# EAGLE design PWR (EAGLE 8.7.1)
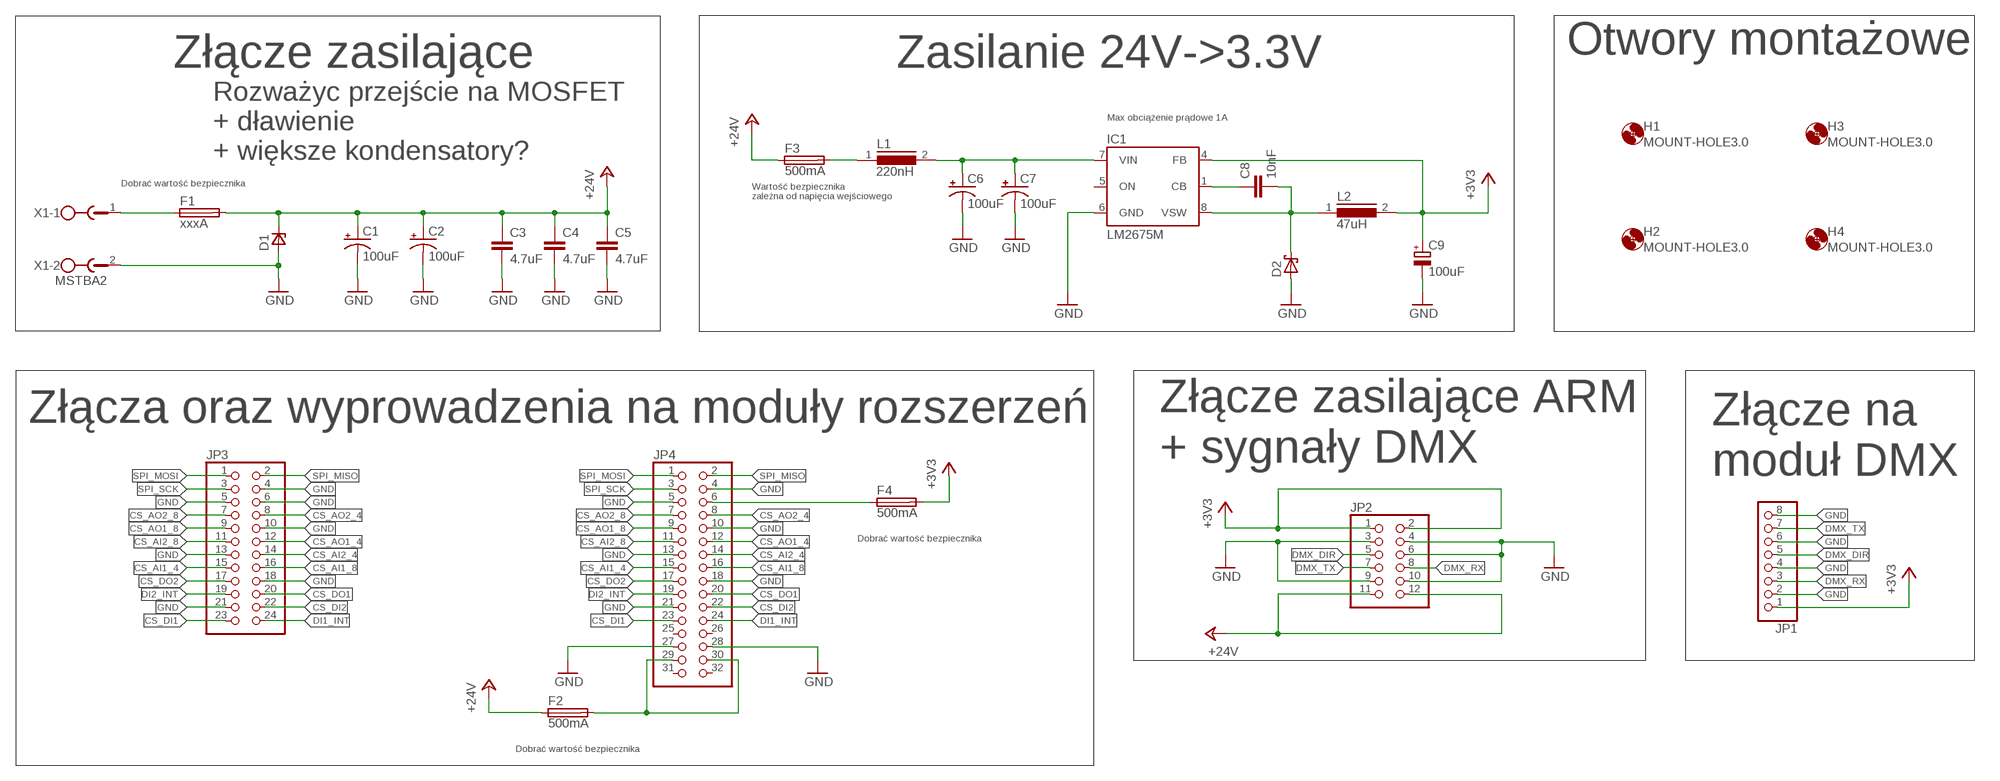
[diagram p0: schematic, sheet 1]

## Parts
C1  100uF  CPOL-USTT5D10  [TT5D10]
C2  100uF  CPOL-USTT5D10  [TT5D10]
C3  4.7uF  C-EUC0805  [C0805]
C4  4.7uF  C-EUC0805  [C0805]
C5  4.7uF  C-EUC0805  [C0805]
C6  100uF  CPOL-USTT5D10  [TT5D10]
C7  100uF  CPOL-USTT5D10  [TT5D10]
C8  10nF  C-EUC0603  [C0603]
C9  100uF  CPOL-EUSMCC  [SMC_C]
D1  P6SMB20A  [SMB_A]
D2  SCHOTTKY-DIODESMD  [SMB]
F1  xxxA  TR5  [TR5]
F2  500mA  TR5  [TR5]
F3  500mA  TR5  [TR5]
F4  500mA  TR5  [TR5]
H1  MOUNT-HOLE3.0  [3,0]
H2  MOUNT-HOLE3.0  [3,0]
H3  MOUNT-HOLE3.0  [3,0]
H4  MOUNT-HOLE3.0  [3,0]
IC1  LM2675M  [SO08]
JP1  PINHD-1X8/90  [1X08/90]
JP2  PINHD-2X6  [2X06]
JP3  PINHD-2X12  [2X12]
JP4  PINHD-2X16/90  [2X16/90]
L1  220nH  SRP7028A-R33M  [7.3X6.3]
L2  47uH  SRR1280-101M  [12.5X12.5]
X1  MSTBA2  [MSTBA2]

## Nets
+3V3: C9.+ F4.2 IC1.4(FB) JP1.1 JP2.1 JP2.2 L2.2
+24V: C1.+ C2.+ C3.1 C4.1 C5.1 D1.C F1.2 F2.1 F3.1 JP2.11 JP2.12
CS_AI1_4: JP3.15 JP4.15
CS_AI1_8: JP3.16 JP4.16
CS_AI2_4: JP3.14 JP4.14
CS_AI2_8: JP3.11 JP4.11
CS_AO1_4: JP3.12 JP4.12
CS_AO1_8: JP3.9 JP4.9
CS_AO2_4: JP3.8 JP4.8
CS_AO2_8: JP3.7 JP4.7
CS_DI1: JP3.23 JP4.23
CS_DI2: JP3.22 JP4.22
CS_DO1: JP3.20 JP4.20
CS_DO2: JP3.17 JP4.17
DI1_INT: JP3.24 JP4.24
DI2_INT: JP3.19 JP4.19
DMX_DIR: JP1.5 JP2.5
DMX_RX: JP1.3 JP2.8
DMX_TX: JP1.7 JP2.7
GND: C1.- C2.- C3.2 C4.2 C5.2 C6.- C7.- C9.- D1.A D2.A IC1.6(GND) JP1.2 JP1.4 JP1.6 JP1.8 JP2.3 JP2.4 JP2.6 JP2.9 JP2.10 JP3.4 JP3.5 JP3.6 JP3.10 JP3.13 JP3.18 JP3.21 JP4.4 JP4.5 JP4.10 JP4.13 JP4.18 JP4.21 JP4.27 JP4.28 X1.2
N$1: F1.1 X1.1
N$2: F4.1 JP4.6
N$3: F2.2 JP4.29 JP4.30
N$10: F3.2 L1.1
N$16: C8.1 IC1.1(CB)
SPI_MISO: JP3.2 JP4.2
SPI_MOSI: JP3.1 JP4.1
SPI_SCK: JP3.3 JP4.3
VIN: C6.+ C7.+ IC1.7(VIN) L1.2
VSW: C8.2 D2.C IC1.8(VSW) L2.1
Unconnected: IC1.5(ON) JP4.25 JP4.26 JP4.31 JP4.32

## Notes on the sheet
- Złącze zasilające | Zasilanie 24V->3.3V | Otwory montażowe
- Max obciążenie prądowe 1A
- Rozważyc przejście na MOSFET
  + dławienie
  + większe kondensatory?
- Dobrać wartość bezpiecznika
- Wartość bezpiecznika 
  zależna od napięcia wejściowego
- Złącza oraz wyprowadzenia na moduły rozszerzeń
- Złącze zasilające ARM
  + sygnały DMX
- Złącze na
  moduł DMX
- Dobrać wartość bezpiecznika
- Dobrać wartość bezpiecznika

## Library data of the parts
C1 C2 C6 C7 = rcl:CPOL-US: POLARIZED CAPACITOR, American symbol; MF: Nichicon; MPN: UPJ1H101MPD6; SPICEPREFIX: C
C3-C5 = rcl:C-EU: CAPACITOR, European symbol; MF: Murata Electronics; MPN: GRM21BR61H475ME51L; SPICEPREFIX: C
C8 = rcl:C-EU: CAPACITOR, European symbol; MF: AVX; MPN: 06035C103KAT2A; SPICEPREFIX: C
C9 = rcl:CPOL-EU: POLARIZED CAPACITOR, European symbol; MF: AVX; MPN: TAJC107K010TNJ; SPICEPREFIX: C
D1 = suppressor_SMAJ_SM6T_P6SMB:P6SMB*A: P6SMBxxA Series of unidirectional Transient Voltage Suppressor Diodes xx = Stand-off Voltage VR in Volts; PPmax = 600 W Case: SMB = DO 214 AA Note: Footprint acc. to ST specs; source: www.st.com Author: Dipl.-Ing. FH Rainer Bayer, www.ing-rb.de/hhn Feedback: rainer.bayer@hs-heilbronn.de; MF: Littelfuse; MPN: TPSMB24A-VR
D2 = diode:SCHOTTKY-DIODE: Schottky Diode; MF: ON Semiconductor; MPN: SS26T3G
F1-F4 = fuse:TR5: FUSE Wickmann; MF: Littelfuse; MPN: 56000001009; OC_FARNELL: unknown; OC_NEWARK: unknown
H1-H4 = holes:MOUNT-HOLE: MOUNTING HOLE with drill center marker
IC1 = v-reg-3:LM2675: National Semiconductor <http://www.national.com> 1.0A "Simple Switcher"(c) 260kHz, Vout 1.2-37V, Vin 40V, 250mOhm DMOS switch, 50µA standby current; MF: Texas Instruments; MPN: LM2675MX-3.3/NOPB
JP1 = pinhead:PINHD-1X8: PIN HEADER; MF: CONNFLY; MPN: DS1024-1*8R0
JP2 = pinhead:PINHD-2X6: PIN HEADER; MF: CONNFLY; MPN: DS1023-2*6S21
JP3 = pinhead:PINHD-2X12: PIN HEADER; MF: CONNFLY; MPN: DS1023-2*12S21
JP4 = pinhead:PINHD-2X16: PIN HEADER; MF: CONNFLY; MPN: DS1024-2*16R0
L1 = wlasne:SRP7028A-R33M: SRP7028A-R33M Manufacturer: Bourns Product Category: Fixed Inductors RoHS: Details Series: SRP7028A Inductance: 330 nH Tolerance: 20 % Maximum DC Current: 32 A Maximum DC Resistance: 3.9 mOhms Minimum Operating Temperature: - 40 C Maximum Operating Temperature: + 150 C Q Minimum: 10 Test Frequency: 100 kHz Product: Power Inductors Shielding: Shielded Termination Style: SMD/SMT Termination: - Mounting Style: SMD/SMT Length: 7.3 mm Width: 6.6 mm Height: 2.8 mm Qualification: AEC-Q200 Packaging: Cut Tape Packaging: MouseReel Packaging: Reel Type: AEC-Q200 Shielded Power Inductor Core Material: Carbonyl Iron Powder Self Resonant Frequency: 140 MHz Brand: Bourns Factory Pack Quantity: 1000 Unit Weight: 1 g; MF: Bourns; MPN: SRP7028A-R22Y
L2 = wlasne:SRR1280-101M: SRR1280-101M Manufacturer: Bourns Product Category: Fixed Inductors RoHS: Details Series: SRR1280 Inductance: 100 uH Tolerance: 20 % Maximum DC Current: 2.1 A Maximum DC Resistance: 150 mOhms Minimum Operating Temperature: - 40 C Maximum Operating Temperature: + 125 C Q Minimum: 18 Product: Power Inductors Shielding: Shielded Termination Style: SMD/SMT Termination: - Mounting Style: SMD/SMT Package/Case: 5050 Length: 12.5 mm Width: 12.5 mm Height: 7.5 mm Packaging: Cut Tape Packaging: MouseReel Packaging: Reel Type: Shielded Power Inductor Self Resonant Frequency: 4.5 MHz Brand: Bourns Factory Pack Quantity: 400 Unit Weight: 4,200 g; MF: Bourns; MPN: SRR1280-470M
X1 = con-phoenix-508:MSTBA2: PHOENIX; MF: DEGSON ELECTRONICS; MPN: 2EDGRC-5.08-02P-14-00A(H); OC_FARNELL: 3705171; OC_NEWARK: 71C4161

## Board
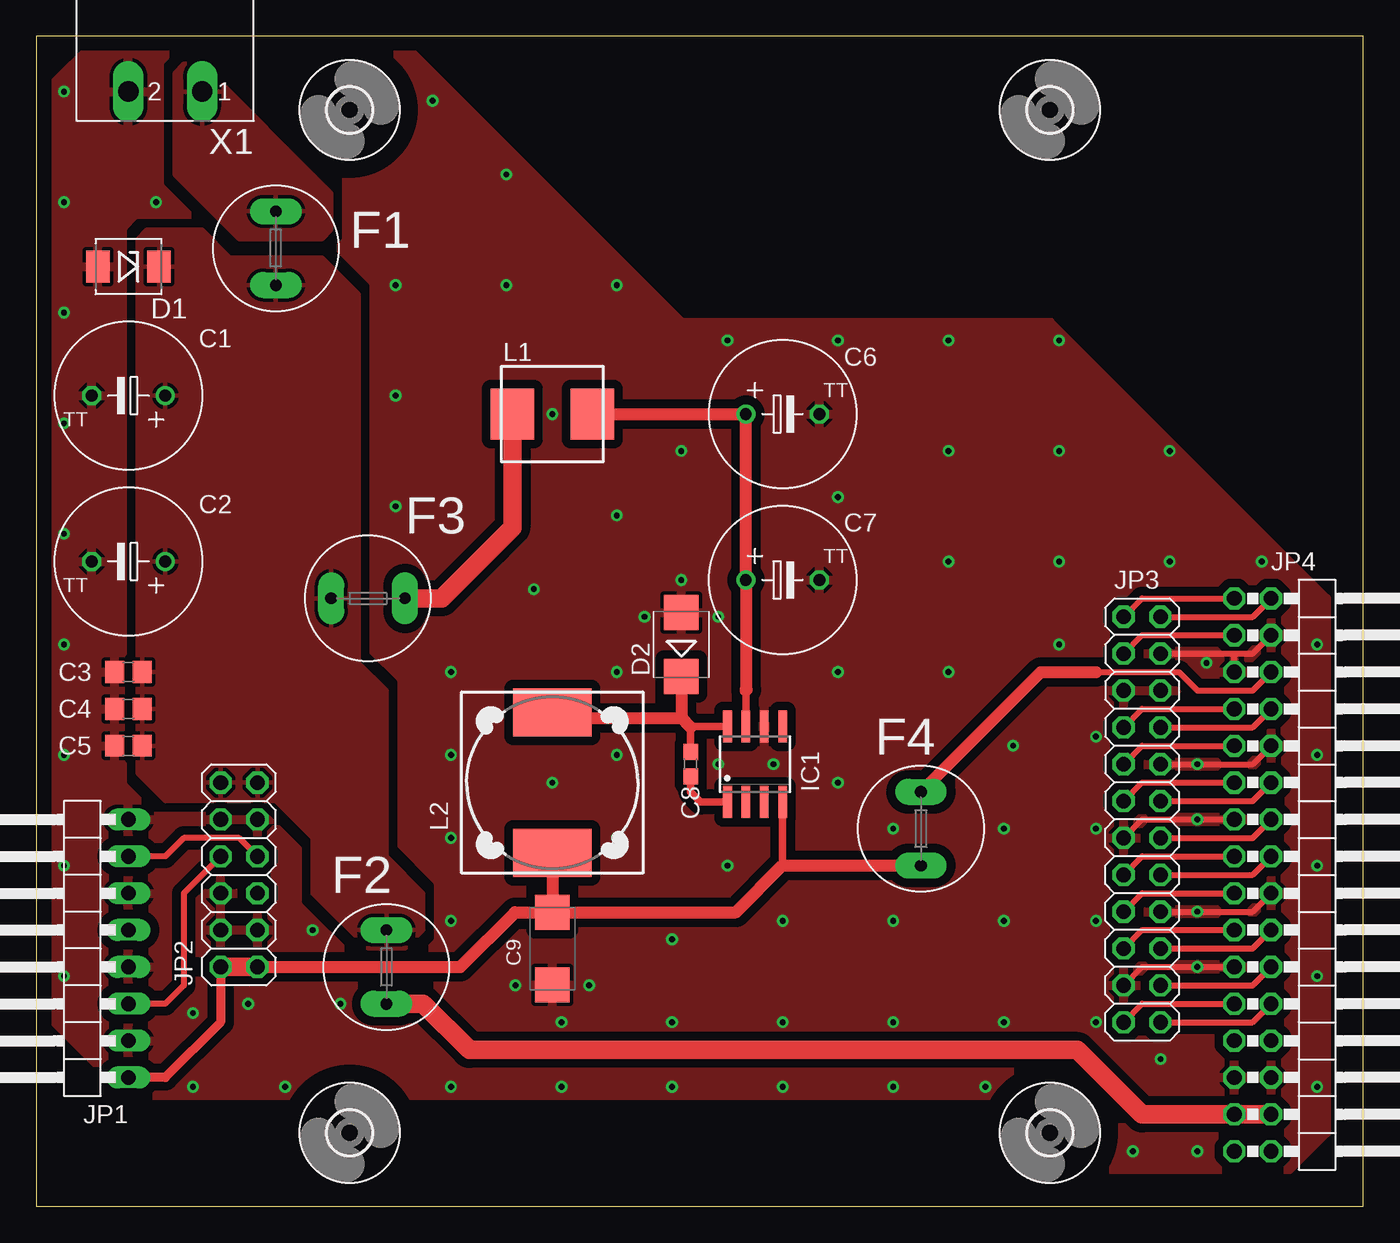
[diagram p1: board, top side]
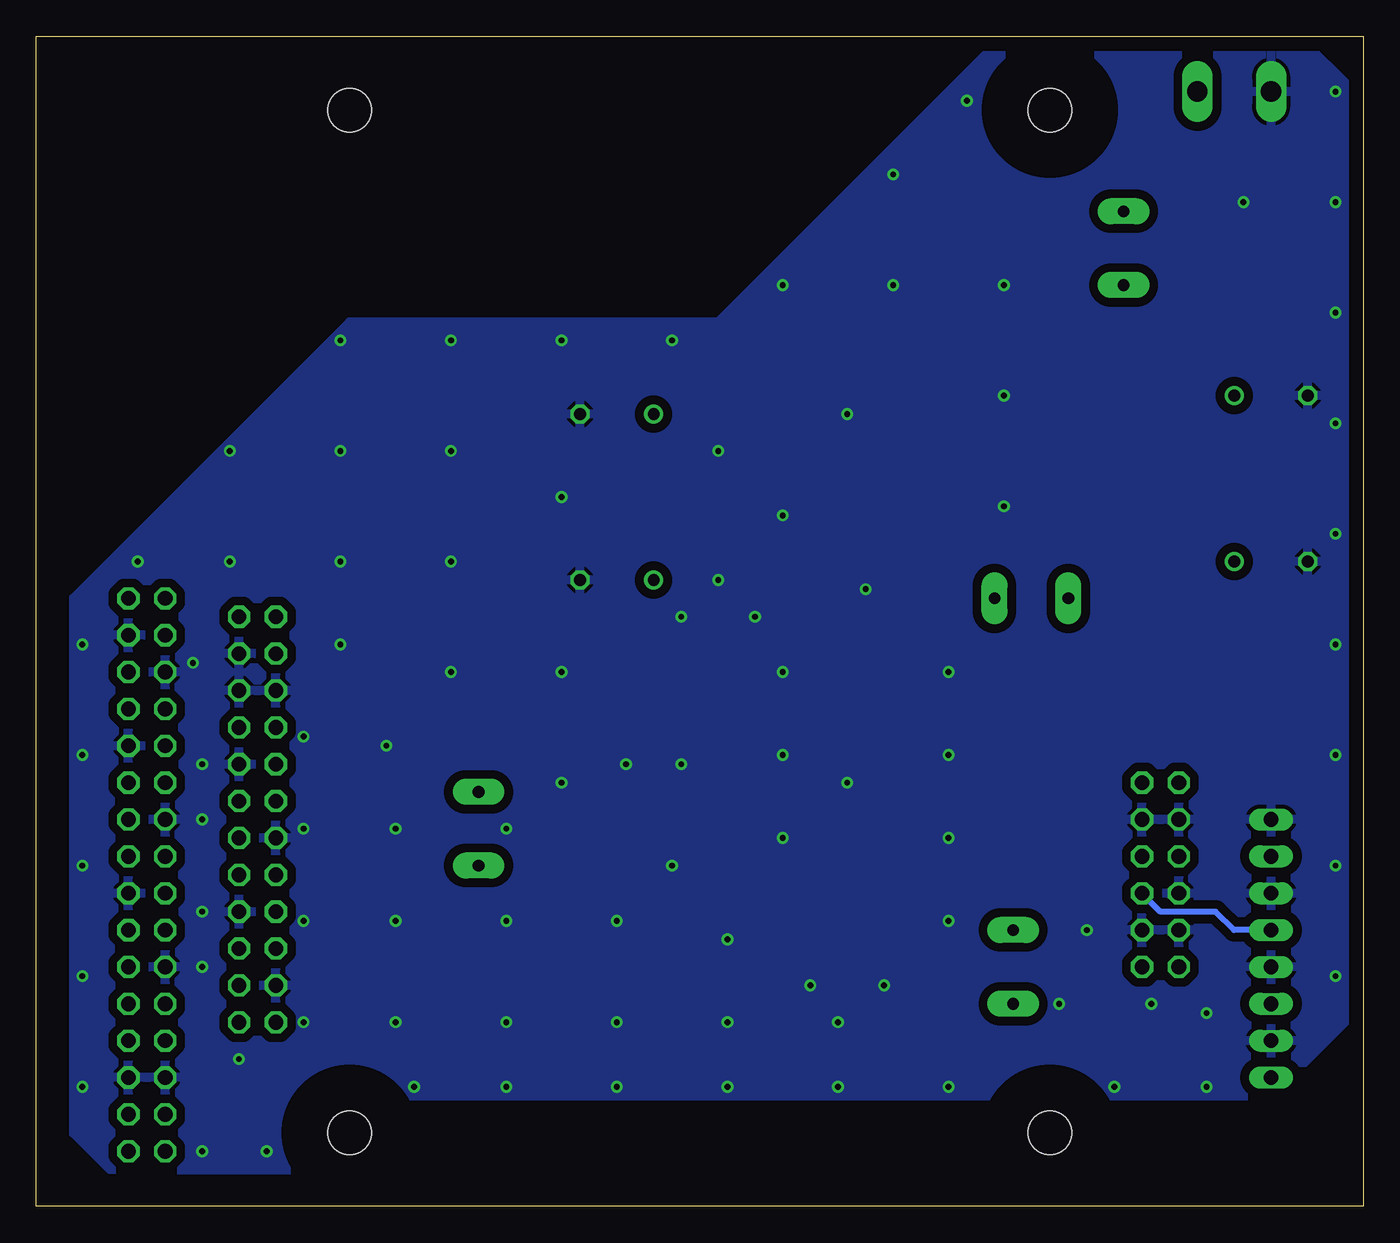
[diagram p2: board, bottom side, seen from below]

Size 91.44 x 80.64 mm. Coordinates in mm from the lower left corner, seen from the top.
Outline: 0,0 91.44,0 91.44,80.64 0,80.64 0,0
Copper layers (1*16): Top 0.035mm / dielectric 1.5mm / Bottom 0.035mm
Design rules "default *": minimum track width 6mil, minimum drill 0.4mm, track to track 10mil, track to pad 10mil, pad to pad 10mil, via to via 12mil, smd to smd 6mil, copper to edge 1mm, drill to drill 6mil, minimum pad ring 10mil, minimum via ring 8mil, stop-mask expansion 4mil, vias tented up to drill 0mil, thermal gap 10mil

### Footprints (pad centres in the part's own frame; a part is rotated, then mirrored left to right if it is on the bottom)
TT5D10 = drill 0.813: + -2.54,0 | drill 0.813 octagon: - 2.54,0
C0805 = smd 1.3 x 1.5: 1 -0.95,0; 2 0.95,0
C0603 = smd 1.1 x 1: 1 -0.85,0; 2 0.85,0
SMC_C = smd 2.4 x 2.4: + -2.5,0; - 2.5,0
SMB_A = smd 1.62 x 2.18: A 2.11,0; C -2.11,0
SMB = smd 2.4 x 2.4: A 2.2,0; C -2.2,0
TR5 = drill 0.813 pad 1.778 long: 1 -2.54,0; 2 2.54,0
3,0 = hole 3: 0,0
SO08 = smd 0.6 x 2.2: 1 -1.905,-2.6; 2 -0.635,-2.6; 3 0.635,-2.6; 4 1.905,-2.6; 5 1.905,2.6; 6 0.635,2.6; 7 -0.635,2.6; 8 -1.905,2.6
1X08/90 = drill 1.016 long: 1 -8.89,-3.81; 2 -6.35,-3.81; 3 -3.81,-3.81; 4 -1.27,-3.81; 5 1.27,-3.81; 6 3.81,-3.81; 7 6.35,-3.81; 8 8.89,-3.81
2X06 = drill 1.016 octagon: 1 -6.35,-1.27; 2 -6.35,1.27; 3 -3.81,-1.27; 4 -3.81,1.27; 5 -1.27,-1.27; 6 -1.27,1.27; 7 1.27,-1.27; 8 1.27,1.27; 9 3.81,-1.27; 10 3.81,1.27; 11 6.35,-1.27; 12 6.35,1.27
2X12 = drill 1.016 octagon: 1 -13.97,-1.27; 2 -13.97,1.27; 3 -11.43,-1.27; 4 -11.43,1.27; 5 -8.89,-1.27; 6 -8.89,1.27; 7 -6.35,-1.27; 8 -6.35,1.27; 9 -3.81,-1.27; 10 -3.81,1.27; 11 -1.27,-1.27; 12 -1.27,1.27; 13 1.27,-1.27; 14 1.27,1.27; 15 3.81,-1.27; 16 3.81,1.27; 17 6.35,-1.27; 18 6.35,1.27; 19 8.89,-1.27; 20 8.89,1.27; 21 11.43,-1.27; 22 11.43,1.27; 23 13.97,-1.27; 24 13.97,1.27
2X16/90 = drill 1.016 octagon: 1 -19.05,-6.35; 2 -19.05,-3.81; 3 -16.51,-6.35; 4 -16.51,-3.81; 5 -13.97,-6.35; 6 -13.97,-3.81; 7 -11.43,-6.35; 8 -11.43,-3.81; 9 -8.89,-6.35; 10 -8.89,-3.81; 11 -6.35,-6.35; 12 -6.35,-3.81; 13 -3.81,-6.35; 14 -3.81,-3.81; 15 -1.27,-6.35; 16 -1.27,-3.81; 17 1.27,-6.35; 18 1.27,-3.81; 19 3.81,-6.35; 20 3.81,-3.81; 21 6.35,-6.35; 22 6.35,-3.81; 23 8.89,-6.35; 24 8.89,-3.81; 25 11.43,-6.35; 26 11.43,-3.81; 27 13.97,-6.35; 28 13.97,-3.81; 29 16.51,-6.35; 30 16.51,-3.81; 31 19.05,-6.35; 32 19.05,-3.81
7.3X6.3 = smd 3 x 3.5: 1 -2.75,0; 2 2.75,0
12.5X12.5 = smd 3.3 x 5.4: 1 -4.85,0; 2 4.85,0
MSTBA2 = drill 1.397 long: 1 -2.54,5.08; 2 2.54,5.08

### Placement (x,y rotation side)
C1  6.35,55.88 180 top
C2  6.35,44.45 180 top
C3  6.35,36.83 180 top
C4  6.35,34.29 180 top
C5  6.35,31.75 180 top
C6  51.44,54.61 0 top
C7  51.44,43.18 0 top
C8  45.09,30.48 90 top
C9  35.56,17.78 270 top
D1  6.35,64.77 180 top
D2  44.45,38.73 90 top
F1  16.51,66.04 270 top
F2  24.13,16.51 270 top
F3  22.86,41.91 0 top
F4  60.96,26.04 270 top
H1  21.59,75.56 0 top
H2  21.59,5.08 0 top
H3  69.85,75.56 0 top
H4  69.85,5.08 0 top
IC1  49.53,30.48 0 top
JP1  2.54,17.78 90 top
JP2  13.97,22.86 90 top
JP3  76.2,26.67 270 top
JP4  88.9,22.86 270 top
L1  35.56,54.61 0 top
L2  35.56,29.21 270 top
X1  8.89,81.92 180 top

### Tracks (layer width: path | path; a pad name or v marks a point on that pad's centre or on a via)
+3V3
  Top 0.508: IC1.4 51.44,23.5
  Top 0.61: JP2.2 12.7,12.7 8.89,8.89 JP1.1
  Top 0.813: JP2.1 29.21,16.51 32.98,20.28 C9.+ | L2.2 C9.+ | C9.+ 48.22,20.28 51.44,23.5 F4.2
  Top 1.27: JP2.1 JP2.2
+24V
  pour Top (isolate 0.406): 22.23,37.47 24.13,35.56 24.13,24.13 26.67,21.59 26.67,19.05 25.4,17.78 22.86,17.78 19.05,21.59 19.05,25.4 16.51,27.94 8.89,27.94 6.99,29.84 6.99,66.67 7.62,67.31 11.43,67.31 13.34,65.41 19.68,65.41 22.23,62.87
CS_AI1_4
  Top 0.406: JP3.15 76.2,24.13 JP4.15
CS_AI1_8
  Top 0.406: JP3.16 83.82,22.86 JP4.16
CS_AI2_4
  Top 0.406: JP3.14 83.82,25.4 JP4.14
CS_AI2_8
  Top 0.406: JP3.11 76.2,29.21 JP4.11
CS_AO1_4
  Top 0.406: JP3.12 83.82,27.94 JP4.12
CS_AO1_8
  Top 0.406: JP3.9 76.2,31.75 JP4.9
CS_AO2_4
  Top 0.406: JP3.8 83.82,33.02 JP4.8
CS_AO2_8
  Top 0.406: JP3.7 76.2,34.29 JP4.7
CS_DI1
  Top 0.406: JP3.23 76.2,13.97 JP4.23
CS_DI2
  Top 0.406: JP3.22 83.82,15.24 JP4.22
CS_DO1
  Top 0.406: JP3.20 83.82,17.78 JP4.20
CS_DO2
  Top 0.406: JP3.17 76.2,21.59 JP4.17
DI1_INT
  Top 0.406: JP3.24 83.82,12.7 JP4.24
DI2_INT
  Top 0.406: JP3.19 76.2,19.05 JP4.19
DMX_DIR
  Bottom 0.406: JP1.5 8.89,19.05 10.16,20.32 13.97,20.32 JP2.5
DMX_RX
  Top 0.406: JP2.8 10.16,21.59 10.16,15.24 8.89,13.97 JP1.3
DMX_TX
  Top 0.406: JP2.7 13.97,25.4 10.16,25.4 8.89,24.13 JP1.7
GND  (via drill 0.4)
  Top 0.406: JP3.4 82.55,38.1 | 82.55,38.1 83.82,38.1 JP4.4 | JP4.5 82.55,38.1 | JP3.10 83.82,30.48 JP4.10 | JP3.13 76.2,26.67 JP4.13 | JP3.18 83.82,20.32 JP4.18 | JP3.21 76.2,16.51 JP4.21
  other vias: 8.26,69.22 1.91,76.83 1.91,69.22 1.91,61.59 1.91,53.98 1.91,46.35 1.91,38.73 1.91,31.11 1.91,23.5 1.91,15.88 10.79,8.26 17.14,8.26 28.57,8.26 36.2,8.26 43.81,8.26 51.44,8.26 59.05,8.26 88.27,8.26 88.27,15.88 88.27,23.5 88.27,31.11 88.27,38.73 84.45,44.45 70.48,52.07 62.87,59.69 55.24,59.69 47.62,59.69 40.01,63.5 32.38,71.12 27.3,76.2 32.38,63.5 24.77,63.5 24.77,55.88 24.77,48.26 62.87,52.07 62.87,44.45 70.48,44.45 62.87,36.83 55.24,36.83 55.24,48.9 55.24,29.21 59.05,12.7 51.44,12.7 43.81,12.7 36.2,12.7 33.02,15.24 38.1,15.24 43.81,18.41 51.44,19.68 59.05,19.68 59.05,26.04 66.67,26.04 66.67,19.68 66.67,12.7 77.47,10.16 44.45,43.18 46.99,40.64 41.91,40.64 40.01,36.83 40.01,47.62 28.57,36.83 28.57,25.4 40.01,25.4 50.8,30.48 46.99,30.48 47.62,23.5 34.29,42.55 14.61,13.97 20.95,13.97 28.57,19.68 28.57,31.11 40.01,31.11 35.56,29.21 19.05,19.05 44.45,52.07 35.56,54.61 70.48,59.69 78.11,52.07 78.11,44.45 73.03,19.68 73.03,12.7 73.03,26.04 73.03,32.38 67.31,31.75 70.48,38.73 65.41,8.26 75.56,3.81 80.01,3.81 80.64,37.47 80.01,30.48 80.01,26.67 80.01,20.32 80.01,16.51 10.79,13.34
  pour Top (isolate 0.61, rank 2): 1.27,77.47 3.81,80.01 25.4,80.01 44.45,60.96 69.85,60.96 88.9,41.91 88.9,5.08 86.36,2.54 71.12,2.54 66.04,7.62 6.35,7.62 1.27,12.7
  pour Bottom (isolate 0.61, rank 2): 1.27,77.47 3.81,80.01 25.4,80.01 44.45,60.96 69.85,60.96 88.9,41.91 88.9,5.08 86.36,2.54 71.12,2.54 66.04,7.62 6.35,7.62 1.27,12.7
N$1
  pour Top (isolate 0.61): 19.68,66.67 20.32,67.31 20.32,69.85 11.43,78.74 10.16,78.74 9.53,78.11 9.53,71.12 13.97,66.67
N$2
  Top 0.406: JP4.6 83.82,35.56 80.01,35.56 78.74,36.83 73.03,36.83
  Top 0.813: F4.1 69.22,36.83 73.03,36.83
N$3
  Top 1.27: F2.2 26.67,13.97 29.84,10.79 71.75,10.79 76.2,6.35 JP4.29 JP4.30
N$10
  Top 1.27: L1.1 32.81,46.78 27.94,41.91 F3.2
N$16
  Top 0.508: IC1.1 45.78,27.88 45.09,28.57 C8.1
SPI_MISO
  Top 0.406: JP3.2 83.82,40.64 JP4.2
SPI_MOSI
  Top 0.406: JP3.1 76.2,41.91 JP4.1
SPI_SCK
  Top 0.406: JP3.3 76.2,39.37 JP4.3
VIN
  Top 0.508: 48.9,35.56 IC1.7
  Top 0.813: 48.9,35.56 48.95,35.61 48.9,35.66 C7.+ C6.+ L1.2
VSW
  Top 0.508: IC1.8 45.02,33.08 | C8.2 45.09,33.02
  Top 0.813: D2.C 44.45,33.66 | 44.45,33.66 45.02,33.08 45.09,33.02 | L2.1 35.97,33.66 44.45,33.66